# EAGLE schematic c64saver_1.1 (EAGLE 6.0)
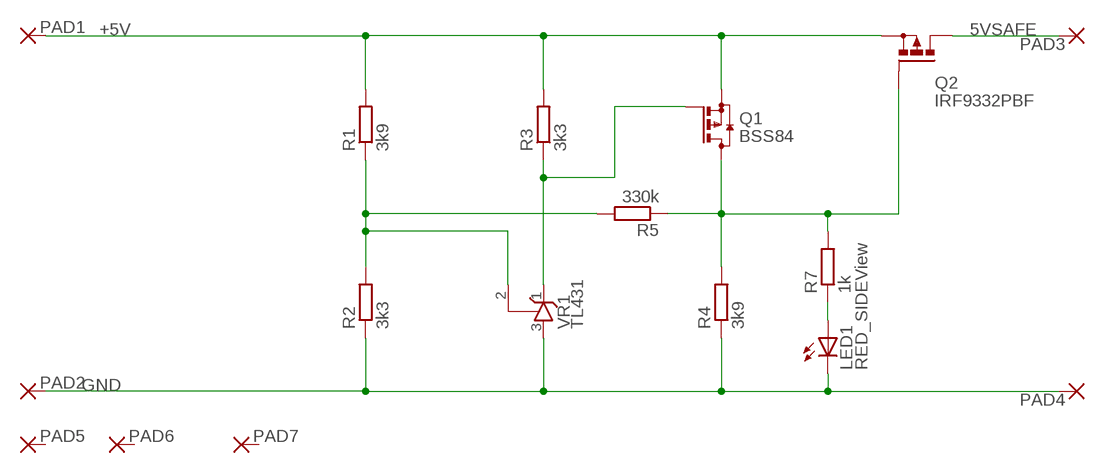
[diagram p0: schematic, sheet 1]

## Parts
LED1  RED_SIDEView  LEDCHIPLED_1206  [CHIPLED_1206]
PAD1  WIREPADSMD1,27-254  [SMD1,27-2,54]
PAD2  WIREPADSMD1,27-254  [SMD1,27-2,54]
PAD3  WIREPADSMD1,27-254  [SMD1,27-2,54]
PAD4  WIREPADSMD1,27-254  [SMD1,27-2,54]
PAD5  WIREPADSMD1,27-254  [SMD1,27-2,54]
PAD6  WIREPADSMD1,27-254  [SMD1,27-2,54]
PAD7  WIREPADSMD1,27-254  [SMD1,27-2,54]
Q1  BSS84  [SOT23]
Q2  IRF9332PBF  P-MOSFET-SO8  [SO-08]
R1  3k9  R-EU_R0603  [R0603]
R2  3k3  R-EU_R0603  [R0603]
R3  3k3  R-EU_R0603  [R0603]
R4  3k9  R-EU_R0603  [R0603]
R5  330k  R-EU_R0603  [R0603]
R7  1k  R-EU_R0603  [R0603]
VR1  TL431  TL431CLPSOT23  [SOT23]

## Nets
5VSAFE: PAD3.1(P) Q2.5(D) Q2.6(D) Q2.7(D) Q2.8(D)
+5V: PAD1.1(P) Q1.2(S) Q2.1(S) Q2.2(S) Q2.3(S) R1.2 R3.2
GND: LED1.C PAD2.1(P) PAD4.1(P) R2.1 R4.1 VR1.3(A)
N$1: LED1.A R7.1
N$2: R1.1 R2.2 R5.2 VR1.2(R)
N$5: Q1.1(G) R3.1 VR1.1(C)
N$7: Q1.3(D) Q2.4(G) R4.2 R5.1 R7.2
Unconnected: PAD5.1(P) PAD6.1(P) PAD7.1(P)

## Library data of the parts
LED1 = led:LED: LED OSRAM: - CHIPLED LG R971, LG N971, LY N971, LG Q971, LY Q971, LO R971, LY R971 LH N974, LH R974 LS Q976, LO Q976, LY Q976 LO Q996 - Hyper CHIPLED LW Q18S LB Q993, LB Q99A, LB R99A - SideLED LS A670, LO A670, LY A670, LG A670, LP A670 LB A673, LV A673, LT A673, LW A673 LH A674 LY A675 LS A676, LA A676, LO A676, LY A676, LW A676 LS A679, LY A679, LG A679 - Hyper Micro SIDELED® LS Y876, LA Y876, LO Y876, LY Y876 LT Y87S - SmartLED LW L88C, LW L88S LB L89C, LB L89S, LG L890 LS L89K, LO L89K, LY L89K LS L896, LA L896, LO L896, LY L896 - TOPLED LS T670, LO T670, LY T670, LG T670, LP T670 LSG T670, LSP T670, LSY T670, LOP T670, LYG T670 LG T671, LOG T671, LSG T671 LB T673, LV T673, LT T673, LW T673 LH T674 LS T676, LA T676, LO T676, LY T676, LB T676, LH T676, LSB T676, LW T676 LB T67C, LV T67C, LT T67C, LS T67K, LO T67K, LY T67K, LW E67C LS E67B, LA E67B, LO E67B, LY E67B, LB E67C, LV E67C, LT E67C LW T67C LS T679, LY T679, LG T679 LS T770, LO T770, LY T770, LG T770, LP T770 LB T773, LV T773, LT T773, LW T773 LH T774 LS E675, LA E675, LY E675, LS T675 LS T776, LA T776, LO T776, LY T776, LB T776 LHGB T686 LT T68C, LB T68C - Hyper Mini TOPLED® LB M676 - Mini TOPLED Santana® LG M470 LS M47K, LO M47K, LY M47K Source: http://www.osram.convergy.de LUXEON: - LUMILED® LXK2-PW12-R00, LXK2-PW12-S00, LXK2-PW14-U00, LXK2-PW14-V00 LXK2-PM12-R00, LXK2-PM12-S00, LXK2-PM14-U00 LXK2-PE12-Q00, LXK2-PE12-R00, LXK2-PE12-S00, LXK2-PE14-T00, LXK2-PE14-U00 LXK2-PB12-K00, LXK2-PB12-L00, LXK2-PB12-M00, LXK2-PB14-N00, LXK2-PB14-P00, LXK2-PB14-Q00 LXK2-PR12-L00, LXK2-PR12-M00, LXK2-PR14-Q00, LXK2-PR14-R00 LXK2-PD12-Q00, LXK2-PD12-R00, LXK2-PD12-S00 LXK2-PH12-R00, LXK2-PH12-S00 LXK2-PL12-P00, LXK2-PL12-Q00, LXK2-PL12-R00 Source: www.luxeon.com KINGBRIGHT: KA-3528ASYC Source: www.kingbright.com
PAD1-PAD7 = wirepad:WIREPAD: Wire PAD connect wire on PCB
Q1 = transistor-small-signal:BSS84: P-CHANNEL MOS FET
Q2 = transistor-power:P-MOSFET-SO8: P-Channel MOSFET Example: FDS4435A; P-Channel Logic Level PowerTrench® MOSFET FDS4465; P-Channel 1.8V Specified PowerTrench® MOSFET Source: www.fairchildsemi.com
R1-R5 R7 = rcl:R-EU_: RESISTOR, European symbol
VR1 = v-reg:TL431CLP: VOLTAGE REGULATOR